# Altium schematic sheet Interface.SchDoc
size 203 x 165 mm; SheetNumber: 1; SheetTotal: 1
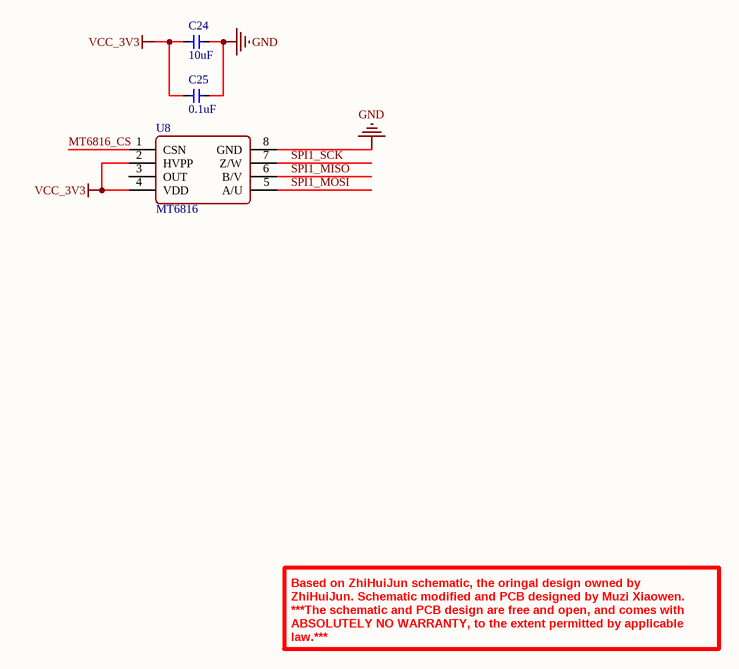
[diagram p0: Interface.SchDoc]

## Parts
C24  10uF  [CAP_0402]
C25  0.1uF  [CAP_0402]
U8  MT6816  [SO-8]

## Nets
GND: C24.1 C25.1 U8.8(GND)
VCC_3V3: C24.2 C25.2 U8.2(HVPP) U8.4(VDD)
MT6816_CS: U8.1(CSN)
SPI1_MISO: U8.6(B/V)
SPI1_MOSI: U8.5(A/U)
SPI1_SCK: U8.7(Z/W)

Not connected (* = marked no-connect by the designer): U8 3(OUT)

## Notes on the sheet
- Based on ZhiHuiJun schematic, the oringal design owned by ZhiHuiJun. Schematic modified and PCB designed by Muzi Xiaowen. ***The schematic and PCB design are free and open, and comes with ABSOLUTELY NO WARRANTY, to the extent permitted by applicable law.***

## Library data of the parts
C24 C25 = 电容-0402: Capacitor; Value: 0.1u
U8 = MT6816: Magnetic Position Sensor